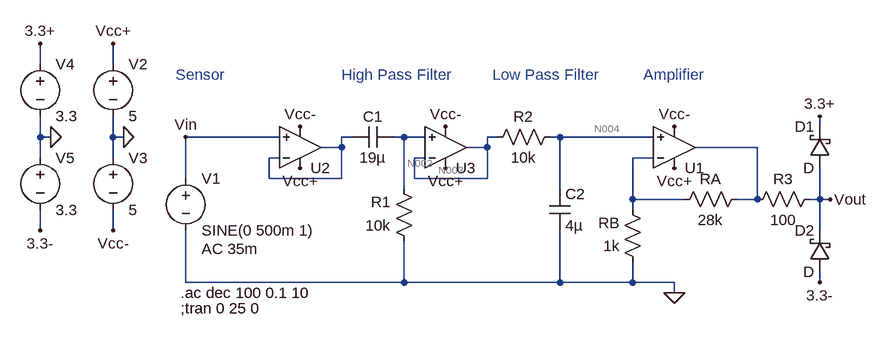
[diagram p0: schematic Heartbeat Stages.asc]
Heartbeat Stages.asc, the LTspice schematic file:
Version 4
SHEET 1 1796 680
WIRE 112 48 112 16
WIRE 224 48 224 16
WIRE 1312 144 1312 128
WIRE 112 160 112 128
WIRE 128 160 112 160
WIRE 224 160 224 128
WIRE 240 160 224 160
WIRE 480 160 336 160
WIRE 592 160 576 160
WIRE 672 160 656 160
WIRE 704 160 672 160
WIRE 816 160 800 160
WIRE 912 160 896 160
WIRE 1056 160 912 160
WIRE 576 176 576 160
WIRE 576 176 544 176
WIRE 800 176 800 160
WIRE 800 176 768 176
WIRE 1216 176 1120 176
WIRE 112 192 112 160
WIRE 224 192 224 160
WIRE 480 192 464 192
WIRE 704 192 688 192
WIRE 1056 192 1024 192
WIRE 336 224 336 160
WIRE 464 224 464 192
WIRE 576 224 576 176
WIRE 576 224 464 224
WIRE 688 224 688 192
WIRE 800 224 800 176
WIRE 800 224 688 224
WIRE 672 240 672 160
WIRE 912 240 912 160
WIRE 1024 256 1024 192
WIRE 1104 256 1024 256
WIRE 1216 256 1216 176
WIRE 1216 256 1184 256
WIRE 1312 256 1312 208
WIRE 1312 256 1296 256
WIRE 1328 256 1312 256
WIRE 1024 272 1024 256
WIRE 112 304 112 272
WIRE 224 304 224 272
WIRE 1312 304 1312 256
WIRE 336 384 336 304
WIRE 672 384 672 320
WIRE 672 384 336 384
WIRE 912 384 912 304
WIRE 912 384 672 384
WIRE 1024 384 1024 352
WIRE 1024 384 912 384
WIRE 1088 384 1024 384
WIRE 1312 384 1312 368
WIRE 1088 400 1088 384
FLAG 1088 400 0
FLAG 240 160 0
FLAG 224 16 Vcc+
FLAG 1088 208 Vcc+
FLAG 224 304 Vcc-
FLAG 1088 144 Vcc-
FLAG 336 160 Vin
FLAG 736 208 Vcc+
FLAG 512 208 Vcc+
FLAG 736 144 Vcc-
FLAG 512 144 Vcc-
FLAG 128 160 0
FLAG 112 16 3.3+
FLAG 112 304 3.3-
FLAG 1312 128 3.3+
FLAG 1312 384 3.3-
FLAG 1328 256 Vout
SYMBOL voltage 336 208 R0
WINDOW 123 24 124 Left 2
WINDOW 39 0 0 Left 0
SYMATTR Value2 AC 35m
SYMATTR InstName V1
SYMATTR Value SINE(0 500m 1)
SYMBOL res 688 336 R180
WINDOW 0 36 76 Left 2
WINDOW 3 36 40 Left 2
SYMATTR InstName R1
SYMATTR Value 10k
SYMBOL res 1200 240 R90
WINDOW 0 0 56 VBottom 2
WINDOW 3 32 56 VTop 2
SYMATTR InstName RA
SYMATTR Value 28k
SYMBOL res 1040 368 R180
WINDOW 0 36 76 Left 2
WINDOW 3 36 40 Left 2
SYMATTR InstName RB
SYMATTR Value 1k
SYMBOL cap 592 176 R270
WINDOW 0 32 32 VTop 2
WINDOW 3 0 32 VBottom 2
SYMATTR InstName C1
SYMATTR Value 19µ
SYMBOL voltage 224 32 R0
WINDOW 123 0 0 Left 0
WINDOW 39 0 0 Left 0
SYMATTR InstName V2
SYMATTR Value 5
SYMBOL voltage 224 176 R0
WINDOW 123 0 0 Left 0
WINDOW 39 0 0 Left 0
SYMATTR InstName V3
SYMATTR Value 5
SYMBOL OpAmps\\UniversalOpAmp 1088 176 M180
SYMATTR InstName U1
SYMBOL res 912 144 R90
WINDOW 0 0 56 VBottom 2
WINDOW 3 32 56 VTop 2
SYMATTR InstName R2
SYMATTR Value 10k
SYMBOL cap 896 240 R0
SYMATTR InstName C2
SYMATTR Value 4µ
SYMBOL OpAmps\\UniversalOpAmp 512 176 M180
SYMATTR InstName U2
SYMBOL OpAmps\\UniversalOpAmp 736 176 M180
SYMATTR InstName U3
SYMBOL res 1312 240 R90
WINDOW 0 0 56 VBottom 2
WINDOW 3 32 56 VTop 2
SYMATTR InstName R3
SYMATTR Value 100
SYMBOL schottky 1328 208 R180
WINDOW 0 24 64 Left 2
WINDOW 3 24 0 Left 2
SYMATTR InstName D1
SYMBOL schottky 1328 368 R180
WINDOW 0 24 64 Left 2
WINDOW 3 24 0 Left 2
SYMATTR InstName D2
SYMBOL voltage 112 32 R0
WINDOW 123 0 0 Left 0
WINDOW 39 0 0 Left 0
SYMATTR InstName V4
SYMATTR Value 3.3
SYMBOL voltage 112 176 R0
WINDOW 123 0 0 Left 0
WINDOW 39 0 0 Left 0
SYMATTR InstName V5
SYMATTR Value 3.3
TEXT 328 400 Left 2 !.ac dec 100 0.1 10
TEXT 328 424 Left 2 !;tran 0 25 0
TEXT 320 64 Left 2 ;Sensor
TEXT 576 64 Left 2 ;High Pass Filter
TEXT 808 64 Left 2 ;Low Pass Filter
TEXT 1040 64 Left 2 ;Amplifier

The netlist it stands for:
* Heartbeat Stages.asc
V1 Vin 0 SINE(0 500m 1) AC 35m
R1 0 N002 10k
RA N005 N006 28k
RB 0 N006 1k
C1 N001 N002 19µ
V2 Vcc+ 0 5
V3 0 Vcc- 5
XU1 N004 N006 Vcc+ Vcc- N005 level1 Avol=1Meg GBW=10Meg Vos=0 En=0 Enk=0 In=0 Ink=0 Rin=500Meg  ; pins In+ In- V+ V- OUT
R2 N004 N003 10k
C2 N004 0 4µ
XU2 Vin N001 Vcc+ Vcc- N001 level1 Avol=1Meg GBW=10Meg Vos=0 En=0 Enk=0 In=0 Ink=0 Rin=500Meg  ; pins In+ In- V+ V- OUT
XU3 N002 N003 Vcc+ Vcc- N003 level1 Avol=1Meg GBW=10Meg Vos=0 En=0 Enk=0 In=0 Ink=0 Rin=500Meg  ; pins In+ In- V+ V- OUT
R3 Vout N005 100
D1 Vout 3.3+ D
D2 3.3- Vout D
V4 3.3+ 0 3.3
V5 0 3.3- 3.3
.model D D
.lib standard.dio
.ac dec 100 0.1 10
;tran 0 25 0
* Sensor
* High Pass Filter
* Low Pass Filter
* Amplifier
.lib UniversalOpAmp1.lib
.backanno
.end

* Results of the author's LTspice run, read from the files saved beside the schematic
* Operating Point, zero values left out:
*   V(vcc+) = 5 V
*   V(vcc-) = -5 V
*   V(3.3+) = 3.3 V
*   V(3.3-) = -3.3 V
*   I(D1) = -3.31 pA
*   I(D2) = -3.31 pA
*   I(V2) = -30 nA
*   I(V3) = -30 nA
*   I(V4) = -3.31 pA
*   I(V5) = -3.31 pA
*   Ix(u1:3) = 10 nA
*   Ix(u1:4) = -10 nA
*   Ix(u2:3) = 10 nA
*   Ix(u2:4) = -10 nA
*   Ix(u3:3) = 10 nA
*   Ix(u3:4) = -10 nA
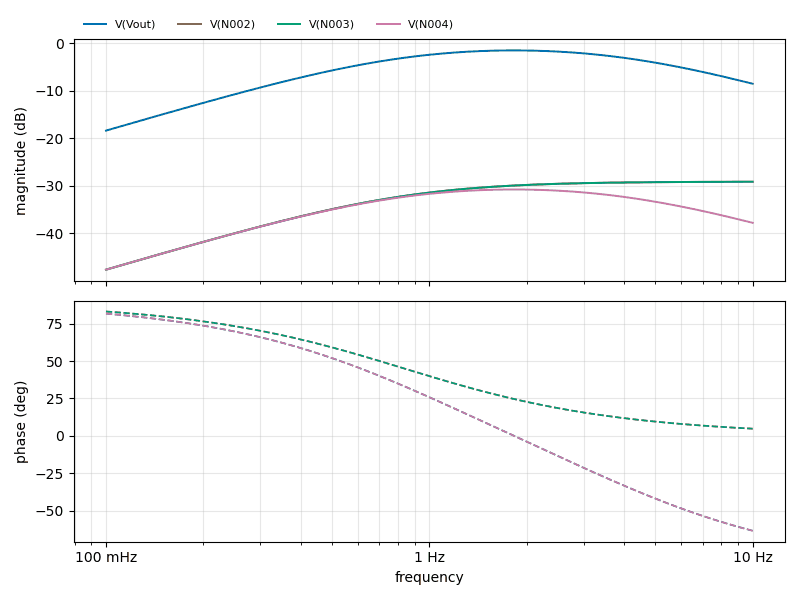
[diagram p1: AC Analysis of Heartbeat Stages.asc, plotted from the saved traces]
* AC Analysis, 1 run:
*   V(Vout): -18.40 dB at 100 mHz, -8.54 dB at 10 Hz, peak -1.53 dB at 1.82 Hz, 3 dB below the peak at 613.8 mHz and 5.43 Hz
*   V(N002): -47.64 dB at 100 mHz, -29.15 dB at 10 Hz, peak -29.15 dB at 10 Hz, 3 dB below the peak at 831.9 mHz
*   V(N003): -47.64 dB at 100 mHz, -29.15 dB at 10 Hz, peak -29.15 dB at 10 Hz, 3 dB below the peak at 831.9 mHz
*   V(N004): -47.64 dB at 100 mHz, -37.79 dB at 10 Hz, peak -30.78 dB at 1.82 Hz, 3 dB below the peak at 613.8 mHz and 5.43 Hz